# EAGLE schematic GPS (EAGLE 9.6.2)
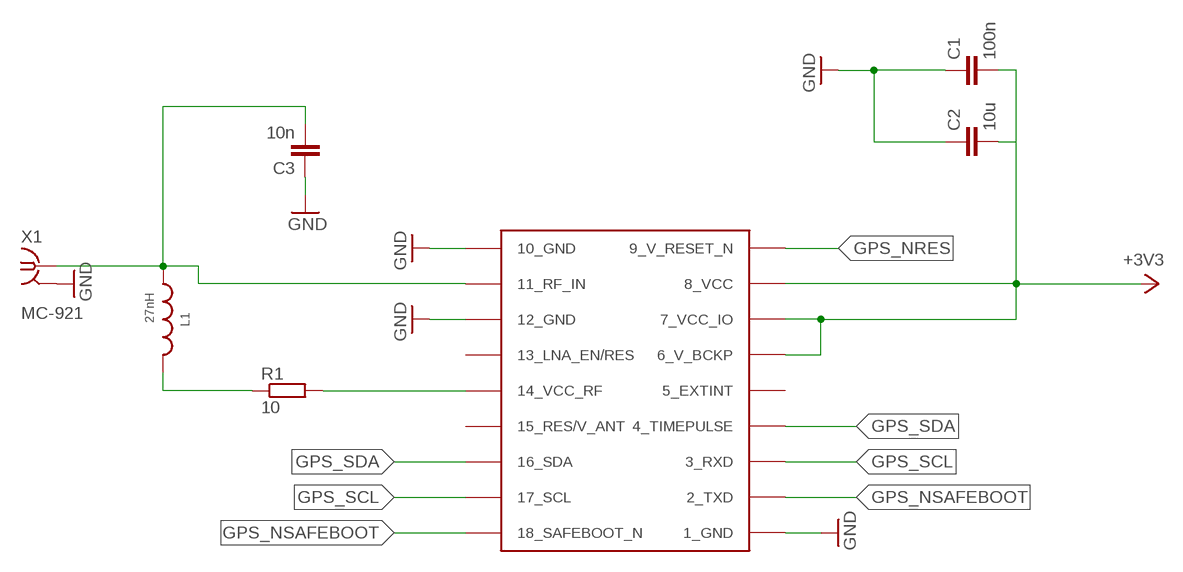
[diagram p0: schematic, sheet 1]

## Parts
C1  100n  C-EUC0805  [C0805]
C2  10u  C-EUC0805  [C0805]
C3  10n  C-EUC0805  [C0805]
L1  27nH  WE-KI_0805_744760127A  [WE-KI_0805]
R1  10  R-EU_R0805  [R0805]
U$1  MAX-M8  [MAX-M8]
X1  MC-921  [MC-921]

## Nets
+3V3: C1.2 C2.2 U$1.6_V_BCKP U$1.7_VCC_IO U$1.8_VCC
GND: C1.1 C2.1 C3.1 U$1.1_GND U$1.10_GND U$1.12_GND X1.2@1(GND) X1.2@2(GND)
GPS_NRES: U$1.9_RESET_N(9_V_RESET_N)
GPS_NSAFEBOOT: U$1.2_TXD U$1.18_SAFEBOOT_N
GPS_SCL: U$1.3_RXD U$1.17_SCL
GPS_SDA: U$1.4_TIMEPULSE U$1.16_SDA
N$1: R1.2 U$1.14_VCC_RF
N$2: L1.2 R1.1
N$3: C3.2 L1.1 U$1.11_RF_IN X1.1
Unconnected: U$1.5_EXTINT U$1.13_LNA_EN(13_LNA_EN/RES) U$1.15_V_ANT/RESERVED(15_RES/V_ANT)

## Library data of the parts
C1-C3 = rcl:C-EU: CAPACITOR, European symbol; SPICEPREFIX: C
L1 = Wurth_Signal & Communications_WE-KI:WE-KI_0805: WE-KI SMD Wire Wound Ceramic Inductor Characteristics WE-KI series offers you an excellent Q factor and highest possible self resonant frequencies up to 12.5 GHz High quality Inductance tolerances: 2% and 5% High thermal stability Recommended soldering: Reflow Operating temperature: –40°C to +125°C Custom designs on request Applications Especially developed for high frequency applications RF transceiver/communications SAT-Receiver Set Top Box Broadband signal transmission Bluetooth Wireless LAN <https://www.we-online.com/catalog/media/o14799v209%20Family_WE-KI_0402A_744765020A_PMDB.jpg> Details see: https://www.we-online.com/catalog/en/WE-KI Updated by Ella Wu 2021-10-11 2021 (C) Wurth Elektronik; DATASHEET-URL: https://www.we-online.com/catalog/datasheet/744760127A.pdf; FRES: 2600MHz; IR: 600mA; MOUNT: SMT; PART-NUMBER: 744760127A; Q-FACTOR: 60; RDC: 0.12Ohm
R1 = rcl:R-EU_: RESISTOR, European symbol; SPICEPREFIX: R
U$1 = ubloxLib:MAX-M8: u-blox MAX GNSS module
X1 = con-coax:MC-921: COAX. MICROWAVE CONNECTOR O/D diam 2.1 Source: www.tycoelectronics.com .. Electronics .. ENG_CD_1775146_A2.pdf; OC_FARNELL: unknown; OC_NEWARK: unknown

## Module CAPCICTOR
Ports: 

### Library data of the parts